# EAGLE design BSPD (EAGLE 8.7.0)
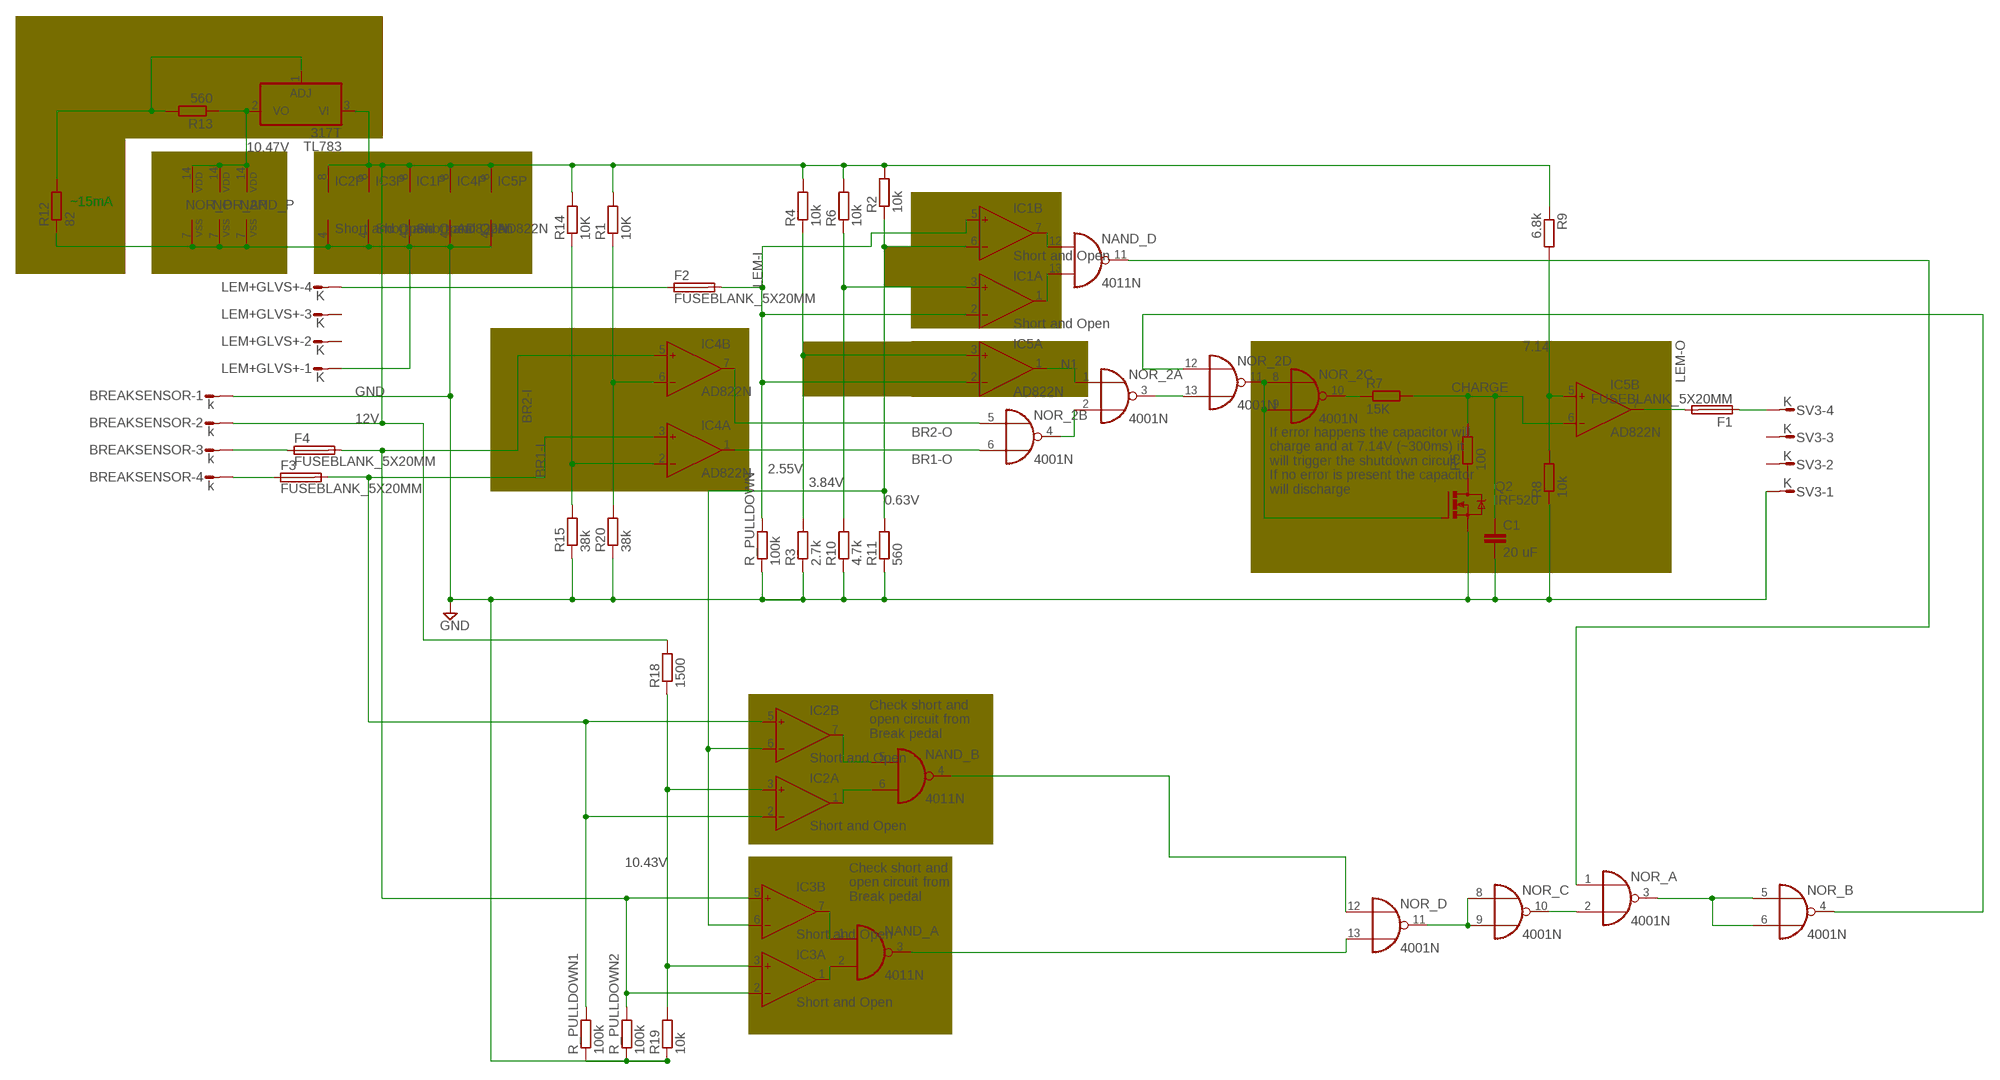
[diagram p0: schematic, sheet 1]

## Parts
BREAKSENSOR  k  L04P  [L04P]
C1  20 uF  C2.5/5  [C2.5-5]
F1  FUSEBLANK_5X20MM  [FUSE_HOLDER_5X20MM]
F2  FUSEBLANK_5X20MM  [FUSE_HOLDER_5X20MM]
F3  FUSEBLANK_5X20MM  [FUSE_HOLDER_5X20MM]
F4  FUSEBLANK_5X20MM  [FUSE_HOLDER_5X20MM]
IC1  Short and Open  AD822N  [DIL08]
IC2  Short and Open  AD822N  [DIL08]
IC3  Short and Open  AD822N  [DIL08]
IC4  AD822N  [DIL08]
IC5  AD822N  [DIL08]
LEM+GLVS+  K  L04P  [L04P]
NAND_  4011N  [DIL14]
NOR_  4001N  [DIL14]
NOR_2  4001N  [DIL14]
Q2  IRF520  [TO220BV]
R1  10K  R-EU_0204/7  [0204/7]
R2  10k  R-EU_0204/7  [0204/7]
R3  2.7k  R-EU_0204/7  [0204/7]
R4  10k  R-EU_0204/7  [0204/7]
R5  100  R-EU_0207/10  [0207/10]
R6  10k  R-EU_0204/7  [0204/7]
R7  15K  R-EU_0207/10  [0207/10]
R8  10k  R-EU_0204/7  [0204/7]
R9  6.8k  R-EU_0204/7  [0204/7]
R10  4.7k  R-EU_0204/7  [0204/7]
R11  560  R-EU_0204/7  [0204/7]
R12  82  R-EU_0204/7  [0204/7]
R13  560  R-EU_0204/7  [0204/7]
R14  10K  R-EU_0204/7  [0204/7]
R15  38k  R-EU_0207/10  [0207/10]
R18  1500  R-EU_0207/10  [0207/10]
R19  10k  R-EU_0207/10  [0207/10]
R20  38k  R-EU_0207/10  [0207/10]
R_PULLDOWN  100k  R-EU_0204/7  [0204/7]
R_PULLDOWN1  100k  R-EU_0204/7  [0204/7]
R_PULLDOWN2  100k  R-EU_0204/7  [0204/7]
SV3  K  L04P  [L04P]
TL783  317T  [TO220H]

## Nets
0.63V: IC1.6(B:IN-) IC2.6(B:IN-) IC3.6(B:IN-) R2.1 R11.2
2.55V: IC5.3(A:IN+) R3.2 R4.1
3.84V: IC1.3(A:IN+) R6.1 R10.2
7.14: IC5.5(B:IN+) R8.2 R9.2
10.43V: IC2.3(A:IN+) IC3.3(A:IN+) R18.1 R19.2
10.47V: NAND_.14(P:VDD) NOR_2.14(P:VDD) NOR_.14(P:VDD) R13.1 TL783.2(VO)
12V: BREAKSENSOR.2 IC1.8(P:V+) IC2.8(P:V+) IC3.8(P:V+) IC4.8(P:V+) IC5.8(P:V+) R1.2 R2.2 R4.2 R6.2 R9.1 R14.2 R18.2 TL783.3(VI)
BR1-I: F3.2 IC2.2(A:IN-) IC2.5(B:IN+) IC4.3(A:IN+) R_PULLDOWN1.2
BR1-O: IC4.1(A:OUT) NOR_2.6(B:I1)
BR2-I: F4.2 IC3.2(A:IN-) IC3.5(B:IN+) IC4.5(B:IN+) R_PULLDOWN2.2
BR2-O: IC4.7(B:OUT) NOR_2.5(B:I0)
CHARGE: C1.1 IC5.6(B:IN-) R5.2 R7.2
GND: BREAKSENSOR.1 C1.2 IC1.4(P:V-) IC2.4(P:V-) IC3.4(P:V-) IC4.4(P:V-) IC5.4(P:V-) LEM+GLVS+.1 NAND_.7(P:VSS) NOR_2.7(P:VSS) NOR_.7(P:VSS) Q2.S R3.1 R8.1 R10.1 R11.1 R12.1 R15.1 R19.1 R20.1 R_PULLDOWN1.1 R_PULLDOWN2.1 R_PULLDOWN.1 SV3.1
LEM-I: F2.2 IC1.2(A:IN-) IC1.5(B:IN+) IC5.2(A:IN-) R_PULLDOWN.2
LEM-O: F1.2 IC5.7(B:OUT)
N1: IC5.1(A:OUT) NOR_2.1(A:I0)
N$1: NOR_2.3(A:O) NOR_2.13(D:I1)
N$2: IC4.2(A:IN-) R14.1 R15.2
N$3: NOR_2.2(A:I1) NOR_2.4(B:O)
N$4: R12.2 R13.2 TL783.1(ADJ)
N$5: NOR_2.8(C:I0) NOR_2.9(C:I1) NOR_2.11(D:O) Q2.G
N$7: NOR_.8(C:I0) NOR_.9(C:I1) NOR_.11(D:O)
N$10: NAND_.3(A:O) NOR_.13(D:I1)
N$11: NOR_2.12(D:I0) NOR_.4(B:O)
N$12: NOR_.2(A:I1) NOR_.10(C:O)
N$13: IC1.1(A:OUT) NAND_.13(D:I1)
N$16: Q2.D R5.1
N$17: F1.1 SV3.4
N$18: F2.1 LEM+GLVS+.4
N$21: IC1.7(B:OUT) NAND_.12(D:I0)
N$23: NAND_.4(B:O) NOR_.12(D:I0)
N$27: IC2.1(A:OUT) NAND_.6(B:I1)
N$28: IC2.7(B:OUT) NAND_.5(B:I0)
N$31: IC3.1(A:OUT) NAND_.2(A:I1)
N$32: IC3.7(B:OUT) NAND_.1(A:I0)
N$34: NAND_.11(D:O) NOR_.1(A:I0)
N$35: BREAKSENSOR.4 F3.1
N$36: NOR_.3(A:O) NOR_.5(B:I0) NOR_.6(B:I1)
N$37: NOR_2.10(C:O) R7.1
N$38: BREAKSENSOR.3 F4.1
NS$3: IC4.6(B:IN-) R1.1 R20.2
Unconnected: LEM+GLVS+.2 LEM+GLVS+.3 NAND_.8(C:I0) NAND_.9(C:I1) NAND_.10(C:O) SV3.2 SV3.3

## Notes on the sheet
- Voltage Regulator
  
  Gate voltage has to be 1.5V lower 
  than supply because of opamps
- ~15mA
- Suppy for Gates | Supply for op amps
- Check open 
  and short 
  circuit for LEM
- Check current through lem 
  is below 40A 
  (2.55V from LEM sensor)
- Compare both break
  sensors with voltage 
  divider reference
- If error happens the capacitor will 
  charge and at 7.14V (~300ms) it 
  will trigger the shutdown circuit
  If no error is present the capacitor 
  will discharge
- Check short and 
  open circuit from 
  Break pedal
- Check short and 
  open circuit from 
  Break pedal

## Library data of the parts
BREAKSENSOR LEM+GLVS+ SV3 = con-amp-mt:L04P: AMP MT CONNECTOR; OC_FARNELL: unknown; OC_NEWARK: unknown
C1 = capacitor-wima:C: CAPACITOR naming: grid - package width
F1-F4 = fuse:FUSE: Fuse; OC_FARNELL: unknown; OC_NEWARK: unknown
IC1-IC5 = analog-devices:AD822: Single-Supply, Rail-to-Rail Low Power FET-Input Op Amp Source: http://www.analog.com/static/imported-files/data_sheets/AD822.pdf; OC_FARNELL: 1438581; OC_NEWARK: unknown
NAND_ = 40xx:4011: Quad 2-input NAND
NOR_ NOR_2 = 40xx:4001: Quad 2-input NOR; SPICEPREFIX: J
Q2 = transistor-power:IRF520: HEXFET Power MOSFET
R1-R4 R6 R8-R14 R_PULLDOWN R_PULLDOWN1 R_PULLDOWN2 = rcl:R-EU_: RESISTOR, European symbol; SPICEPREFIX: R
R5 R7 R15 R18-R20 = resistor:R-EU_: RESISTOR, European symbol
TL783 = linear:*317: Positive VOLTAGE REGULATOR

## Board
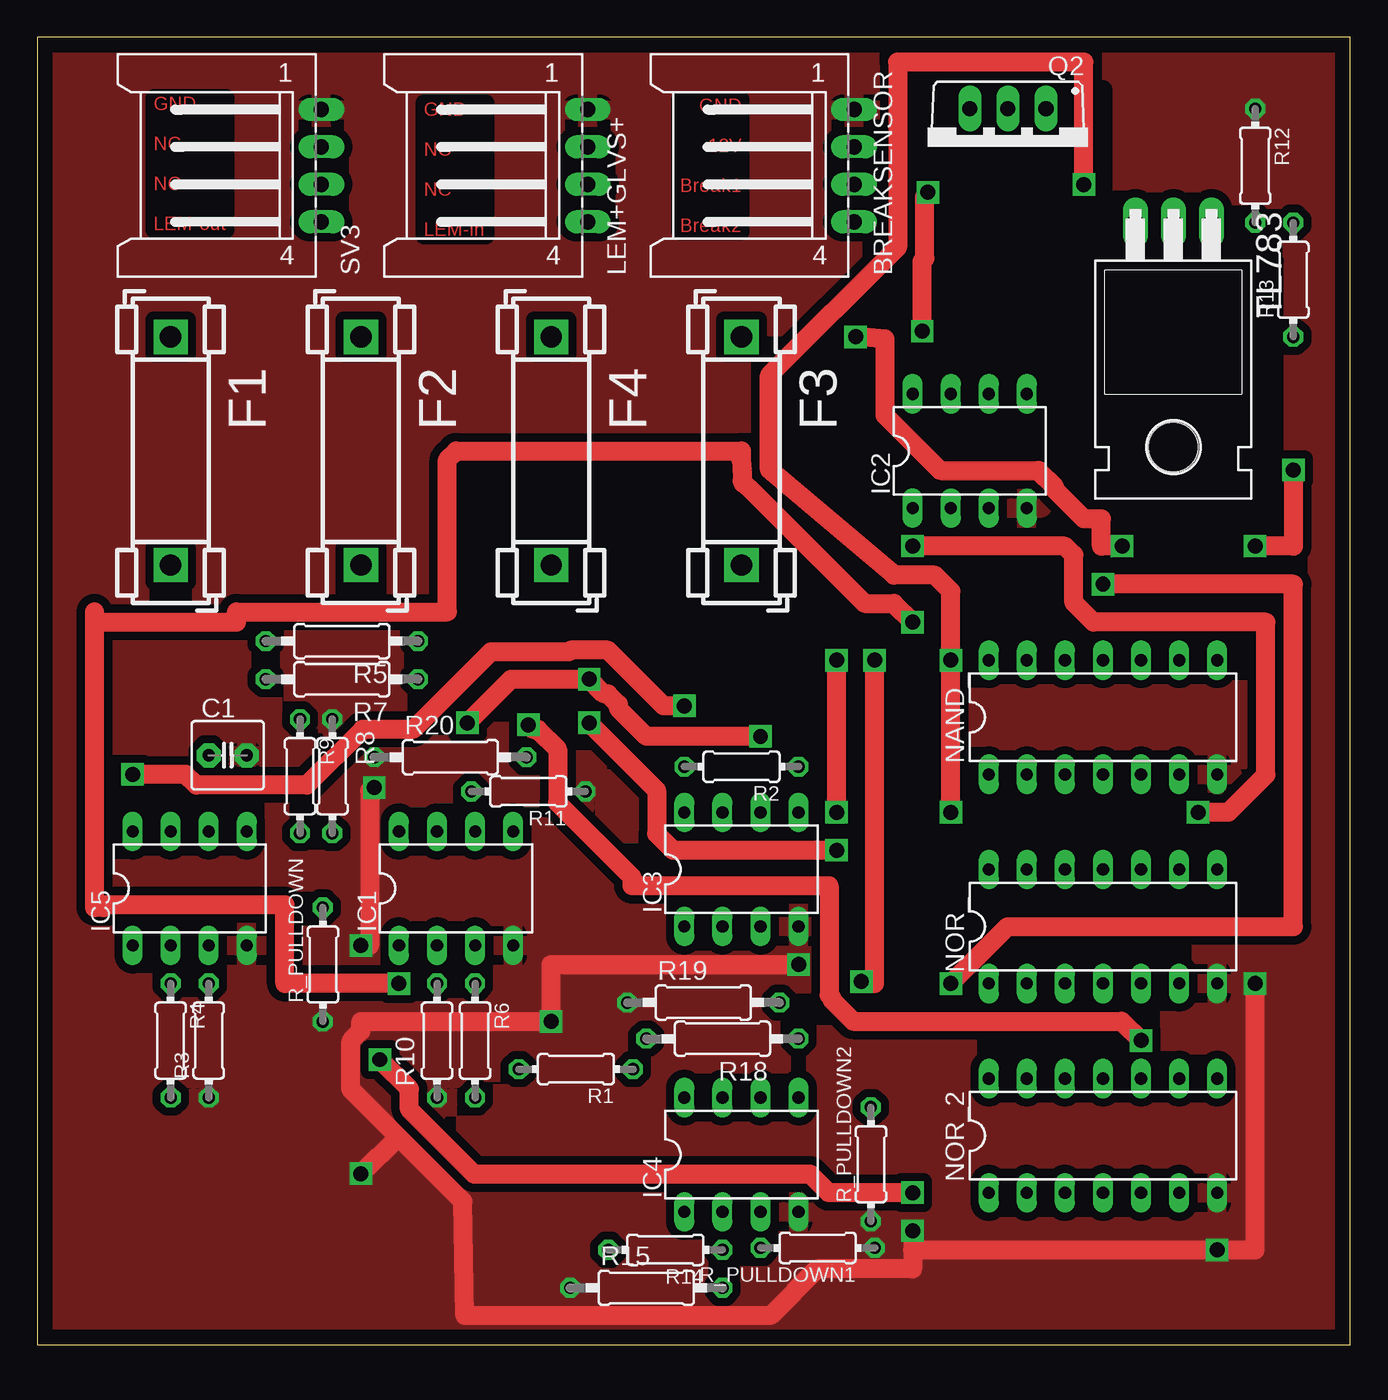
[diagram p1: board, top side]
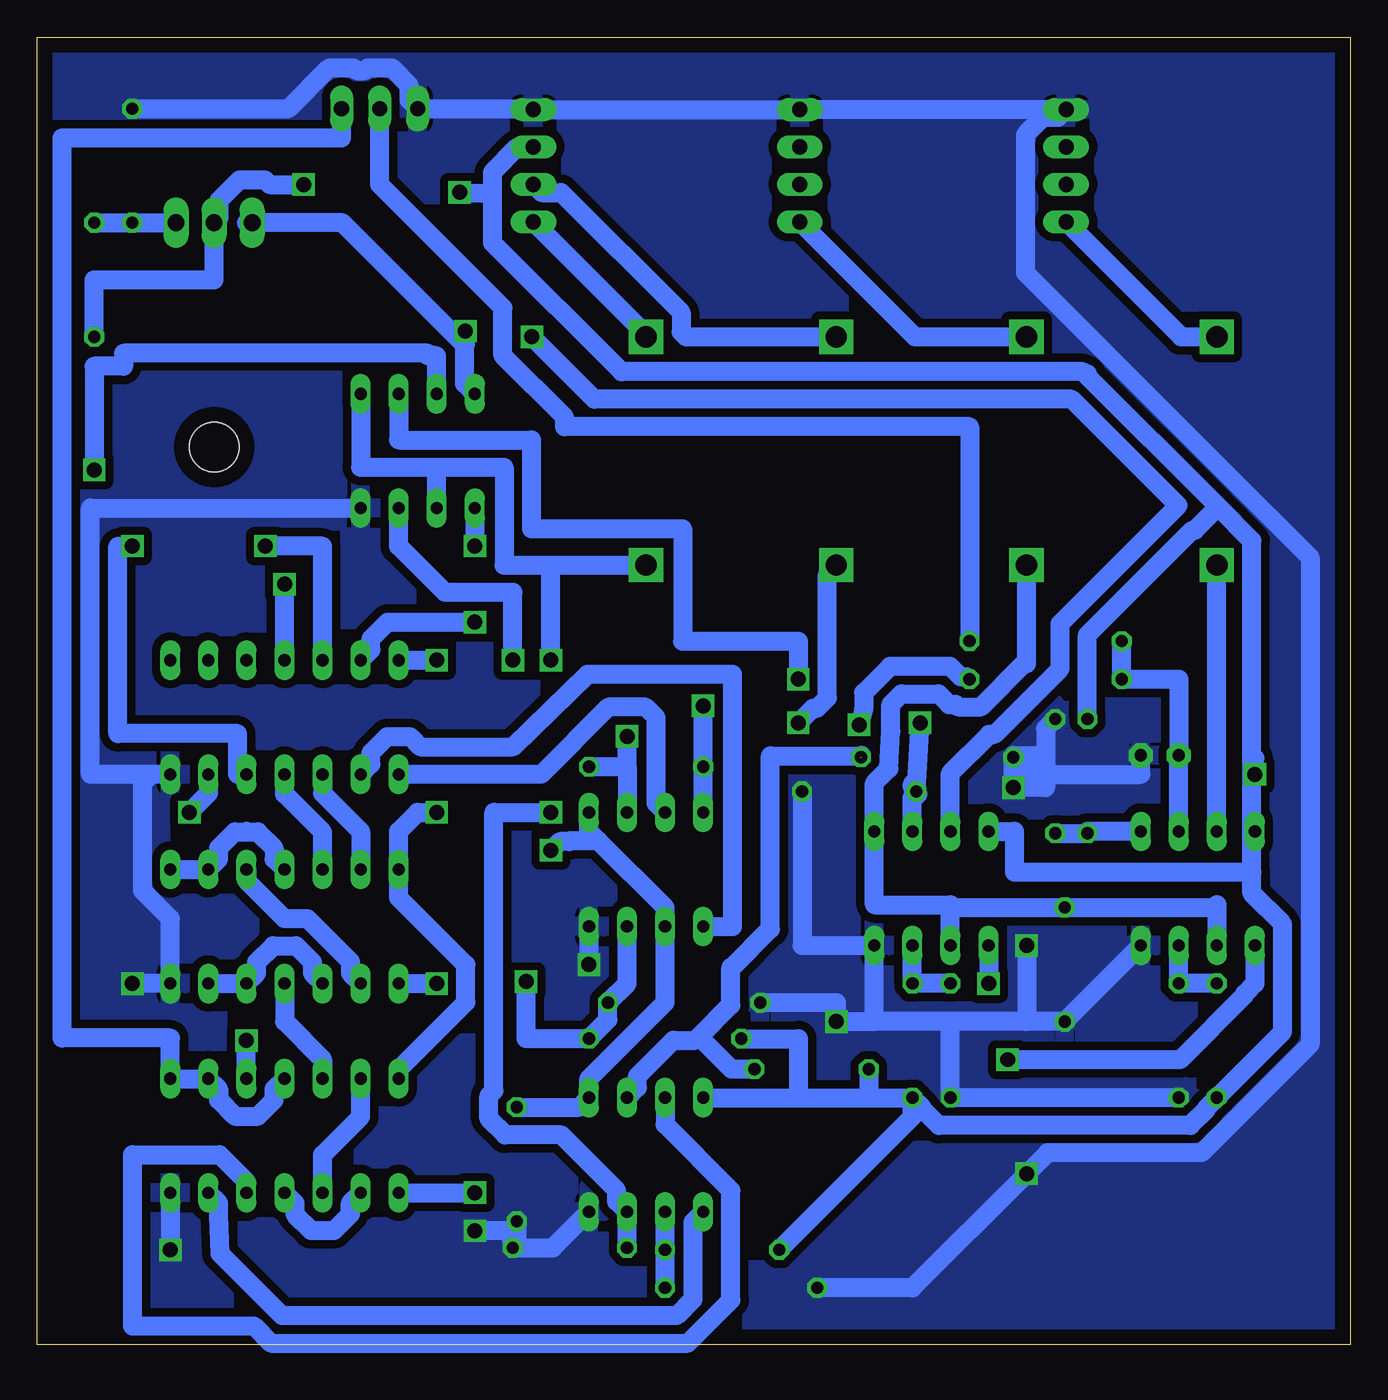
[diagram p2: board, bottom side, seen from below]

Size 87.61 x 87.3 mm. Coordinates in mm from the lower left corner, seen from the top.
Outline: 0,0 87.61,0 87.61,87.3 0,87.3 0,0
Copper layers (1*16): Top 0.035mm / dielectric 1.5mm / Bottom 0.035mm
Design rules "default *": minimum track width 6mil, minimum drill 0.35mm, track to track 22mil, track to pad 22mil, pad to pad 22mil, via to via 22mil, smd to smd 22mil, copper to edge 40mil, drill to drill 6mil, minimum pad ring 10mil, minimum via ring 8mil, stop-mask expansion 4mil, vias tented up to drill 0mil, thermal gap 10mil

### Footprints (pad centres in the part's own frame; a part is rotated, then mirrored left to right if it is on the bottom)
L04P = drill 1.016 long: 1 3.75,-6.25; 2 1.25,-6.25; 3 -1.25,-6.25; 4 -3.75,-6.25
C2.5-5 = drill 0.813 pad 1.6 octagon: 1 -1.27,0; 2 1.27,0
FUSE_HOLDER_5X20MM = drill 1.422 pad 2.286 square: 1 0,0; 2 15.24,0
DIL08 = drill 0.813 long: 1 -3.81,-3.81; 2 -1.27,-3.81; 3 1.27,-3.81; 4 3.81,-3.81; 5 3.81,3.81; 6 1.27,3.81; 7 -1.27,3.81; 8 -3.81,3.81
DIL14 = drill 0.813 long: 1 -7.62,-3.81; 2 -5.08,-3.81; 3 -2.54,-3.81; 4 0,-3.81; 5 2.54,-3.81; 6 5.08,-3.81; 7 7.62,-3.81; 8 7.62,3.81; 9 5.08,3.81; 10 2.54,3.81; 11 0,3.81; 12 -2.54,3.81; 13 -5.08,3.81; 14 -7.62,3.81
TO220BV = drill 1.016 long: D 0,-2.54; G -2.54,-2.54; S 2.54,-2.54
0204/7 = drill 0.813 octagon: 1 -3.81,0; 2 3.81,0
0207/10 = drill 0.813 octagon: 1 -5.08,0; 2 5.08,0
TO220H = drill 1.118 long: 1 -2.54,-10.16; 2 0,-10.16; 3 2.54,-10.16 | hole 3.302: 0,4.826

### Placement (x,y rotation side)
BREAKSENSOR  48.26,78.74 90 top
C1  12.7,39.37 0 top
F1  8.89,67.31 270 top
F2  21.59,67.31 270 top
F3  46.99,67.31 270 top
F4  34.29,67.31 270 top
IC1  27.94,30.48 0 top
IC2  62.23,59.69 0 top
IC3  46.99,31.75 0 top
IC4  46.99,12.7 0 top
IC5  10.16,30.48 0 top
LEM+GLVS+  30.48,78.74 90 top
NAND_  71.12,41.91 0 top
NOR_  71.12,27.94 0 top
NOR_2  71.12,13.97 0 top
Q2  64.77,80.01 180 top
R1  35.94,18.41 180 top
R2  46.99,38.61 180 top
R3  11.43,20.32 90 top
R4  8.89,20.32 270 top
R5  20.32,46.99 180 top
R6  29.21,20.32 270 top
R7  20.32,44.45 180 top
R8  19.68,37.97 270 top
R9  17.53,37.97 270 top
R10  26.67,20.32 90 top
R11  32.77,36.96 180 top
R12  81.28,78.74 270 top
R13  83.82,71.12 90 top
R14  41.91,6.35 180 top
R15  40.64,3.81 0 top
R18  45.72,20.45 180 top
R19  44.45,22.86 0 top
R20  27.56,39.24 0 top
R_PULLDOWN  19.05,25.4 90 top
R_PULLDOWN1  52.07,6.48 180 top
R_PULLDOWN2  55.63,12.06 90 top
SV3  12.7,78.74 90 top
TL783  75.82,64.77 180 top

### Tracks (layer width: path | path; a pad name or v marks a point on that pad's centre or on a via)
0.63V  (via drill 1)
  Top 1.27: v48.26,40.64 40.64,40.64 38.77,42.51 38.77,42.77 38.07,43.47 37.81,43.47 v36.83,44.45 31.62,44.45 v28.7,41.53
  Bottom 1.27: IC1.6 29.21,36.65 28.96,36.65 | 28.96,36.65 R11.2 | 28.83,36.77 28.96,36.65 | R11.2 29.21,37.21 29.21,37.46 28.96,37.72 | R11.2 v28.7,41.53 | R2.1 48.26,38.61 | 48.26,38.61 IC3.6 | 48.26,38.61 v48.26,40.64 | IC2.6 63.5,60.43 54.63,60.43 54.63,54.51 44.55,54.51 44.55,46.99 36.83,46.99 v36.83,44.45
2.55V
  Bottom 1.27: R4.1 R3.2 IC5.3
3.84V
  Bottom 1.27: IC1.3 R6.1 R10.2
7.14
  Bottom 1.27: IC5.5 17.53,34.29 R9.2 R8.2
10.43V  (via drill 1)
  Top 1.27: v54.99,24.26 55.88,24.13 v55.88,45.72
  Bottom 1.27: IC2.3 63.5,53.34 60.4,50.24 55.88,50.24 v55.88,45.72 | IC3.3 48.26,24.13 R19.2 49.53,21.72 R18.1 54.99,20.45 v54.99,24.26
10.47V  (via drill 1)
  Top 1.27: v60.96,35.56 v60.96,45.72 60.96,50.33 59.89,51.4 57.18,51.4 48.86,58.45 48.86,64.74 57.4,73.29 57.4,85.65 69.85,85.65 v69.85,77.47
  Bottom 1.27: R13.1 83.82,71.12 75.82,71.12 TL783.2 75.49,75.26 75.49,76.43 74.12,77.8 72.44,77.8 72.11,77.47 v69.85,77.47 | NOR_2.14 63.5,18.4 59.02,22.89 59.02,25.37 63.5,29.86 NOR_.14 63.5,34.29 62.23,35.56 v60.96,35.56 | NAND_.14 v60.96,45.72
12V  (via drill 1)
  Top 1.27: v59.05,67.69 59.05,72.36 59.23,72.53 59.23,76.76 v59.44,76.96 | v43.18,42.67 41.8,42.67 38.07,46.39 35.59,46.39 35.47,46.28 30.26,46.28 25.08,41.1 21.71,41.1 17.99,37.38 10.6,37.38 9.88,38.1 v6.35,38.1
  Bottom 1.27: IC5.8 6.55,34.49 | 6.55,34.49 6.55,39.37 | 6.55,39.37 6.55,53.71 8.81,55.96 | 8.81,55.96 17.7,64.85 | 17.7,64.85 17.82,64.97 48.63,64.97 57.23,73.57 57.23,76.88 | BREAKSENSOR.2 55.54,79.99 57.23,78.3 57.23,76.88 | 17.53,64.85 17.7,64.85 | IC1.8 22.4,34.29 22.4,31.57 6.55,31.57 | 6.55,31.57 6.55,34.49 | 8.81,55.96 10.36,54.41 10.53,54.41 17.53,47.41 R9.1 | R6.2 28.52,15.82 28.52,15.74 27.44,14.66 10.66,14.66 9.58,15.74 9.58,15.82 R4.2 4.5,20.9 4.5,28.1 6.55,30.16 6.55,31.57 | IC4.8 36.83,16.51 | 36.83,16.51 31.75,16.51 | 31.75,16.51 R6.2 | R18.2 36.83,20.45 36.83,16.51 | IC3.8 R2.2 v43.18,42.67 43.18,42.58 | 73.66,74.93 TL783.3 67.26,74.93 59.11,66.77 | IC2.8 59.11,64.19 59.11,66.77 | 59.11,66.77 59.05,66.82 v59.05,67.69 | v59.44,76.96 57.23,76.88 | v6.35,38.1 6.35,39.17 6.55,39.37 | R1.2 32.13,16.89 31.75,16.51 | R14.2 29.21,15.24 R6.2
BR1-I  (via drill 1)
  Top 1.27: v53.34,35.56 v53.34,45.72
  Bottom 1.27: R_PULLDOWN1.2 IC4.3 48.95,9.58 48.95,10.32 52.65,14.02 56.39,14.02 57.48,15.11 57.48,16.64 57.15,16.97 57.15,35.56 v53.34,35.56 | 53.34,52.07 56.46,52.07 56.46,58.6 60.96,58.6 | 53.34,52.07 F3.2 | IC2.2 60.96,58.6 | v53.34,45.72 53.34,52.07 | 60.96,58.6 66.04,58.6 IC2.5
BR1-O
  Bottom 1.27: NOR_2.6 75.51,9.47 75.51,8.64 75.42,6.1 71.28,1.96 44.95,1.96 43.87,3.04 43.87,8.2 IC4.1
BR2-I  (via drill 1)
  Top 1.27: v36.83,41.53 41.33,37.03 41.33,34.13 42.41,33.05 53.31,33.05 v53.34,33.02
  Bottom 1.27: 50.16,33.66 45.72,29.21 IC3.2 45.72,22.86 50.8,17.78 IC4.5 51.43,15.88 R_PULLDOWN2.2 | 50.16,33.66 50.8,34.29 IC3.5 | 50.16,33.66 52.06,33.66 52.1,33.62 52.74,33.62 v53.34,33.02 | v36.83,41.53 35.85,42.51 35.59,42.51 34.89,43.21 34.89,51.47 F4.2
BR2-O
  Bottom 1.27: IC4.7 45.72,14.71 41.33,10.32 41.33,3 44.19,0.13 72.04,0.13 73.18,1.27 81.28,1.27 81.28,12.7 75.46,12.7 73.69,10.93 73.69,10.18 NOR_2.5
CHARGE
  Bottom 1.27: IC5.6 C1.1 11.43,44.45 R7.2 R5.2
GND  (via drill 1)
  Top 1.27: v22.48,37.21 22.48,37.01 22.17,37.01 22.17,26.67 v21.59,26.67 | v81.28,24.13 81.28,6.35 v78.74,6.35 58.42,6.35 v58.42,7.62 58.42,5.08 52.02,5.08 48.9,1.96 28.52,1.96 28.4,9.58 24.07,13.91 | v50.8,25.4 34.29,25.4 v34.29,21.59 21.59,21.59 21.59,20.97 20.92,20.29 20.92,17.05 24.07,13.91 | v21.59,11.43 24.07,13.91
  Bottom 1.27: 20.32,39.37 20.32,38.1 | 20.32,38.1 13.97,38.1 C1.2 | 20.32,39.37 22.48,39.37 R20.1 22.48,38.1 | 21.59,21.59 R_PULLDOWN.1 IC5.4 | 21.59,21.59 26.67,21.59 | 26.67,21.59 31.75,21.59 | 31.75,21.59 IC1.4 36.58,26.67 R11.1 | 26.67,21.59 R10.1 R3.1 | R_PULLDOWN1.1 53.21,6.48 IC4.4 | R19.1 34.29,22.86 v34.29,21.59 31.75,21.59 | v21.59,26.67 21.59,21.59 | 22.48,38.1 v22.48,37.21 20.32,37.21 20.32,38.1 | 20.32,38.1 22.48,38.1 | R_PULLDOWN2.1 55.63,6.73 R_PULLDOWN1.1 | R12.1 70.84,82.55 68.12,85.27 66.5,85.27 66.32,85.09 65.76,85.09 65.58,85.27 63.96,85.27 62.81,84.12 62.81,83.13 Q2.S 54.57,82.55 BREAKSENSOR.1 LEM+GLVS+.1 SV3.1 19.49,81.95 20.52,81.95 21.67,80.8 21.67,71.58 2.67,52.58 2.67,20.06 9.9,12.83 20.19,12.83 v21.59,11.43 29.21,3.81 R15.1 | R8.1 20.32,41.15 20.32,39.37 | NOR_2.7 v78.74,6.35 | v81.28,24.13 NOR_.7 78.74,28.47 80.59,30.32 80.59,37.52 80.01,38.1 | R_PULLDOWN1.1 56.01,7.62 v58.42,7.62 | NAND_.7 80.01,38.1 | 80.01,38.1 84.07,38.1 84.07,55.88 IC2.4 | IC3.4 v50.8,25.4
  pour Top: -3.81,91.44 -3.81,-3.81 92.71,-3.81 92.71,91.44
  pour Bottom: -2.54,-2.54 90.17,-2.54 90.17,88.9 -2.54,88.9
LEM-I
  Bottom 1.27: IC1.2 26.67,29.39 | IC5.2 8.89,29.39 9.07,29.21 R_PULLDOWN.2 26.49,29.21 26.67,29.39 | 26.67,29.39 31.75,29.39 IC1.5 31.75,37.51 30.79,38.48 30.65,40.98 30.65,42.77 29.95,43.47 27.46,43.47 26.76,42.77 | 26.76,42.77 26.76,42.74 | F2.2 21.59,45.49 21.74,45.49 24.63,42.6 26.17,42.6 26.35,42.77 26.76,42.77
LEM-O
  Bottom 1.27: IC5.7 F1.2
N1  (via drill 1)
  Top 1.27: v22.86,19.05 24.82,17.09 24.82,15.74 29.15,11.41 51.57,11.41 52.81,10.16 v58.42,10.16
  Bottom 1.27: IC5.1 6.35,24.13 7.04,23.44 7.04,23.36 11.35,19.05 v22.86,19.05 | NOR_2.1 v58.42,10.16
N$1
  Bottom 1.27: NOR_2.13 66.04,15.24 68.58,12.7 NOR_2.3
N$2
  Bottom 1.27: R15.2 R14.1 IC4.2
N$3
  Bottom 1.27: NOR_2.4 70.43,9.47 70.43,8.73 69.35,7.64 67.81,7.64 66.73,8.73 66.73,9.47 NOR_2.2
N$4
  Bottom 1.27: R13.2 R12.2 TL783.1
N$5
  Bottom 1.27: NOR_2.11 71.81,17.09 71.81,16.35 72.89,15.27 74.43,15.27 75.51,16.35 75.51,17.09 NOR_2.9 NOR_2.8 78.74,20.5 85.96,20.5 85.96,80.59 69.85,80.59 69.01,80.59 67.31,80.59 Q2.G
N$7
  Bottom 1.27: NOR_.8 NOR_.9 75.51,32.44 75.51,33.18 74.43,34.27 73.69,34.27 73.66,34.29 73.64,34.27 72.89,34.27 71.81,33.18 71.81,32.44 NOR_.11
N$8
  cutout Top: 69.85,72.39 69.85,55.88 71.12,55.88 82.55,55.88 82.55,72.39
N$9
  cutout Top: 59.69,80.01 59.69,63.5 71.12,63.5 71.12,83.82 59.69,83.82
N$10
  Bottom 1.27: NAND_.3 68.58,36.83 66.04,34.29 NOR_.13
N$11
  Bottom 1.27: NOR_2.12 68.58,19.05 71.12,21.59 NOR_.4
N$12
  Bottom 1.27: NOR_.10 73.64,31.73 73.64,30.98 71.13,28.47 69.59,28.47 66.73,25.6 66.73,24.82 NOR_.2
N$13  (via drill 1)
  Top 1.27: 3.81,48.26 3.81,29.21 4.39,29.21 4.39,29.39 16.51,29.39 16.51,24.13 v24.13,24.13 | 3.81,48.26 3.81,48.95 | 3.81,48.26 13.28,48.26 13.28,48.95 27.36,48.95 27.36,59.11 27.94,59.69 46.99,59.69 46.99,59.07 46.97,59.05 47.03,58.37 47.03,57.69 47.09,57.63 47.1,57.54 47.62,57.1 55.2,49.51 57.17,49.51 v58.42,48.26
  Bottom 1.27: IC1.1 v24.13,24.13 | NAND_.13 65.35,46.41 65.35,47.15 64.24,48.26 v58.42,48.26
N$16
  Bottom 1.27: R5.1 25.4,61.32 52.43,61.32 52.43,61.94 56.55,66.07 56.55,69.25 64.77,77.47 64.77,80.01 64.77,81.28 Q2.D 64.64,82.55
N$17
  Bottom 1.27: SV3.4 11.27,67.31 F1.1
N$18
  Bottom 1.27: LEM+GLVS+.4 29.05,67.31 F2.1
N$21  (via drill 1)
  Top 1.27: v72.39,53.34 71.01,53.34 71.01,55.17 69.85,55.17 67.89,57.12 67.89,57.31 66.81,58.4 60.24,58.4 56.57,62.07 56.57,67.18 55.17,67.31 v54.61,67.31
  Bottom 1.27: IC1.7 26.67,38.18 24.09,40.77 23.73,40.77 19.36,45.14 19.36,48.17 11.48,56.04 18.58,63.14 50.44,63.14 v54.61,67.31 | NAND_.12 68.58,53.34 v72.39,53.34
N$23
  Bottom 1.27: NOR_.12 68.58,34.24 71.12,36.78 NAND_.4
N$27  (via drill 1)
  Top 1.27: v77.47,35.56 77.5,35.59 79.51,35.59 81.99,38.07 81.99,48.26 70.47,48.26 69.18,49.56 69.18,52.74 68.58,53.34 v58.42,53.34
  Bottom 1.27: IC2.1 v58.42,53.34 | NAND_.6 76.2,36.83 v77.47,35.56
N$28  (via drill 1)
  Top 1.27: v83.82,58.42 83.82,53.34 v81.28,53.34
  Bottom 1.27: NAND_.5 74.24,38.1 74.24,40.82 82.25,40.82 82.25,53.34 v81.28,53.34 | IC2.7 60.96,66.04 61.54,66.04 61.54,66.22 81.86,66.22 81.86,65.35 83.82,65.35 v83.82,58.42
N$31
  Bottom 1.27: NAND_.2 65.35,38.79 65.35,39.53 64.27,40.62 62.73,40.62 62.05,39.93 55.88,39.93 50.89,44.79 41.22,44.79 41.22,27.94 IC3.1
N$32
  Bottom 1.27: NAND_.1 53.99,38.1 49.5,42.58 47.02,42.58 46.32,41.88 46.32,36.16 IC3.7
N$34  (via drill 1)
  Top 1.27: v60.96,24.13 64.77,27.94 83.82,27.94 83.82,50.8 v71.12,50.8
  Bottom 1.27: NOR_.1 v60.96,24.13 | NAND_.11 v71.12,50.8
N$35
  Bottom 1.27: BREAKSENSOR.4 46.99,67.47 F3.1
N$36
  Bottom 1.27: NOR_.6 NOR_.5 72.97,24.82 72.97,25.56 71.89,26.65 70.35,26.65 69.27,25.56 69.27,24.82 NOR_.3
N$37  (via drill 1)
  Top 1.27: v32.77,41.4 33.07,41.1 33.41,41.1 34.72,39.78 34.72,36.19 39.69,31.22 39.69,30.66 52.84,30.66 52.84,23.35 53.05,23.15 53.05,23.01 54.44,21.62 72.37,21.62 v73.66,20.32
  Bottom 1.27: R7.1 25.44,44.45 25.59,44.6 26,44.6 26.7,45.3 30.7,45.3 32.47,43.53 32.47,42.45 v32.77,41.4 | NOR_2.10 v73.66,20.32
N$38
  Bottom 1.27: F4.1 44.33,67.31 44.65,67.63 44.65,68.95 52.65,76.95 53.97,76.95 BREAKSENSOR.3
NS$3  (1 unrouted)
  Bottom 1.27: IC4.6 47.57,17.2 47.57,17.94 45.17,20.34 43.68,20.34 43.44,20.58 | 43.44,20.58 41.33,22.7 41.33,25.22 41.22,25.22 38.68,27.76 38.68,39.34 32.61,39.34 | 32.61,39.23 32.61,39.34 | 32.61,39.34 32.61,39.37 32.64,39.34 | R1.1 41.27,18.41 43.44,20.58

### Text on the board
Top: GND / / 12V / / Break1 / / Break2 | GND / / NC / / NC / / LEM-out | GND / / NC / / NC / / LEM-in